# EAGLE design MODULO_DRIVE_CC (EAGLE 7.5.0)
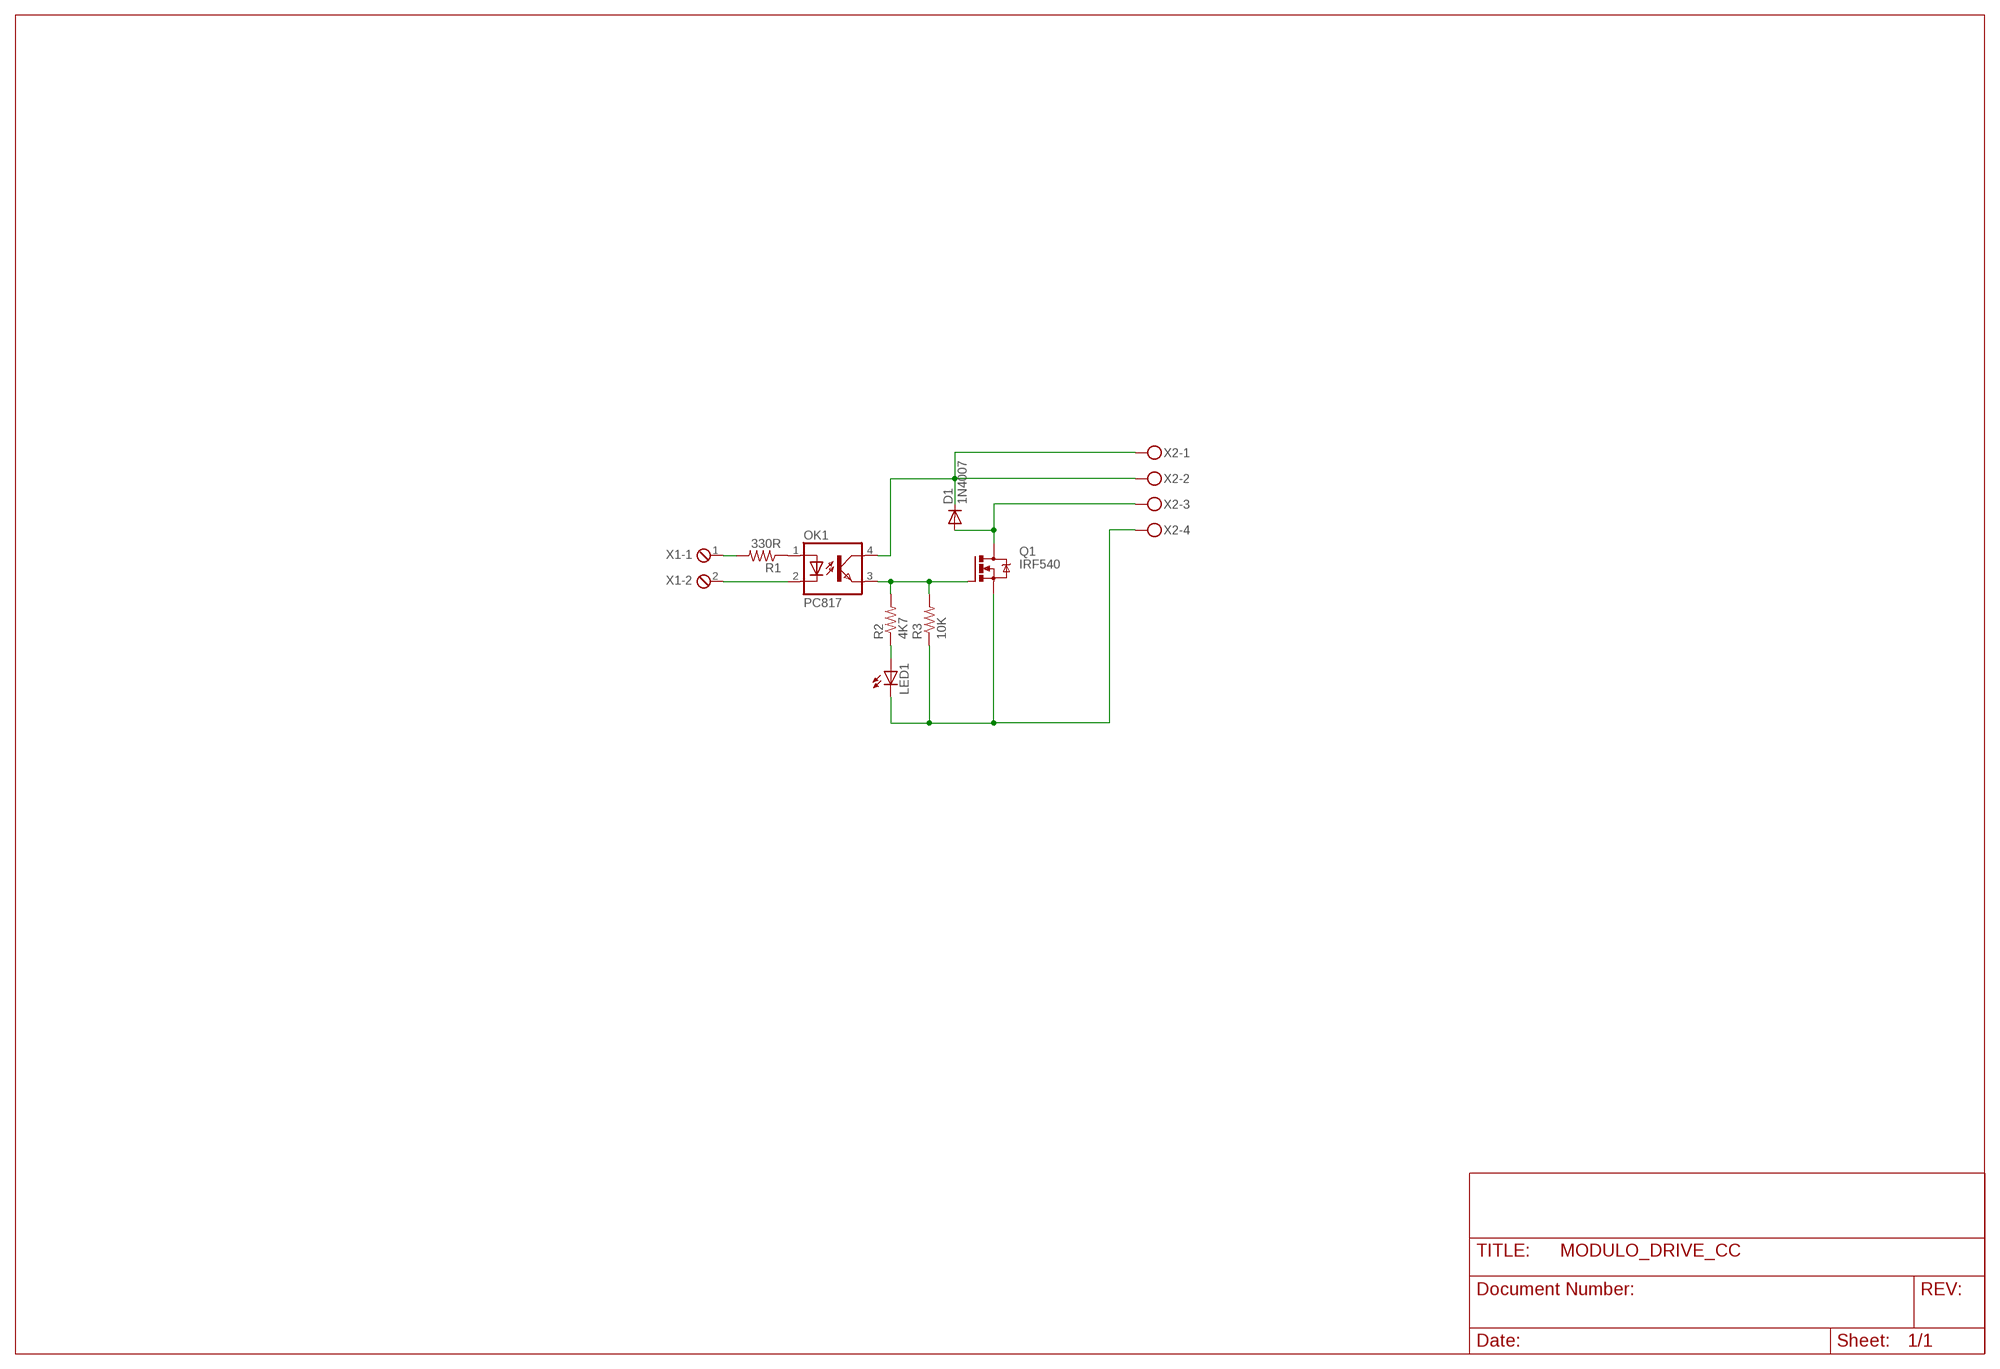
[diagram p0: schematic, sheet 1]

## Parts
D1  1N4007  1N4004  [DO41-10]
LED1  LED3MM  [LED3MM]
OK1  PC817  [DIL04]
Q1  IRF540  [TO220BV]
R1  330R  RESISTORPTH-1/4W  [AXIAL-0.4]
R2  4K7  RESISTORPTH-1/4W  [AXIAL-0.4]
R3  10K  RESISTORPTH-1/4W  [AXIAL-0.4]
X1  MPT2  [2POL254]
X2  MKDSN1,5/4-5,08  [MKDSN1,5/4-5,08]

## Nets
N$35: D1.A Q1.D X2.3
N$36: D1.C OK1.4(COL) X2.1 X2.2
N$37: LED1.K(C) Q1.S R3.P$1 X2.4
N$39: OK1.3(EMIT) Q1.G R2.P$2 R3.P$2
N$41: LED1.A R2.P$1
N$43: OK1.1(A) R1.P$1
N$49: R1.P$2 X1.1
N$50: OK1.2(C) X1.2

## Library data of the parts
D1 = diode:1N4004: DIODE general purpose rectifier, 1 A
LED1 = led:LED: LED OSRAM: - CHIPLED LG R971, LG N971, LY N971, LG Q971, LY Q971, LO R971, LY R971 LH N974, LH R974 LS Q976, LO Q976, LY Q976 LO Q996 - Hyper CHIPLED LW Q18S LB Q993, LB Q99A, LB R99A - SideLED LS A670, LO A670, LY A670, LG A670, LP A670 LB A673, LV A673, LT A673, LW A673 LH A674 LY A675 LS A676, LA A676, LO A676, LY A676, LW A676 LS A679, LY A679, LG A679 - Hyper Micro SIDELED® LS Y876, LA Y876, LO Y876, LY Y876 LT Y87S - SmartLED LW L88C, LW L88S LB L89C, LB L89S, LG L890 LS L89K, LO L89K, LY L89K LS L896, LA L896, LO L896, LY L896 - TOPLED LS T670, LO T670, LY T670, LG T670, LP T670 LSG T670, LSP T670, LSY T670, LOP T670, LYG T670 LG T671, LOG T671, LSG T671 LB T673, LV T673, LT T673, LW T673 LH T674 LS T676, LA T676, LO T676, LY T676, LB T676, LH T676, LSB T676, LW T676 LB T67C, LV T67C, LT T67C, LS T67K, LO T67K, LY T67K, LW E67C LS E67B, LA E67B, LO E67B, LY E67B, LB E67C, LV E67C, LT E67C LW T67C LS T679, LY T679, LG T679 LS T770, LO T770, LY T770, LG T770, LP T770 LB T773, LV T773, LT T773, LW T773 LH T774 LS E675, LA E675, LY E675, LS T675 LS T776, LA T776, LO T776, LY T776, LB T776 LHGB T686 LT T68C, LB T68C - Hyper Mini TOPLED® LB M676 - Mini TOPLED Santana® LG M470 LS M47K, LO M47K, LY M47K Source: http://www.osram.convergy.de LUXEON: - LUMILED® LXK2-PW12-R00, LXK2-PW12-S00, LXK2-PW14-U00, LXK2-PW14-V00 LXK2-PM12-R00, LXK2-PM12-S00, LXK2-PM14-U00 LXK2-PE12-Q00, LXK2-PE12-R00, LXK2-PE12-S00, LXK2-PE14-T00, LXK2-PE14-U00 LXK2-PB12-K00, LXK2-PB12-L00, LXK2-PB12-M00, LXK2-PB14-N00, LXK2-PB14-P00, LXK2-PB14-Q00 LXK2-PR12-L00, LXK2-PR12-M00, LXK2-PR14-Q00, LXK2-PR14-R00 LXK2-PD12-Q00, LXK2-PD12-R00, LXK2-PD12-S00 LXK2-PH12-R00, LXK2-PH12-S00 LXK2-PL12-P00, LXK2-PL12-Q00, LXK2-PL12-R00 Source: www.luxeon.com KINGBRIGHT: KA-3528ASYC Source: www.kingbright.com
OK1 = optocoupler:PC817: SHARP OPTO COUPLER; MPN: PC817X4J000F; OC_FARNELL: 9707727; OC_NEWARK: 97K7059
Q1 = transistor-power:IRF540: HEXFET Power MOSFET
R1-R3 = SparkFun:RESISTOR: Resistor Basic schematic elements and footprints for 0603, 1206, and PTH resistors.
X1 = con-phoenix-254:MPT2: PHOENIX CONNECTOR; OC_FARNELL: unknown; OC_NEWARK: unknown
X2 = con-phoenix-508:MKDSN1,5/4-5,08: MKDSN 1,5/ 4-5,08 Printklemme Nennstrom: 13,5 A Nennspannung: 250 V Rastermaß: 5,08 mm Polzahl: 4 Anschlussart: Schraubanschluss Montage: Löten Anschlussrichtung Leiter/Platine: 0 ° Artikelnummer: 1729144 Source: http://eshop.phoenixcontact.com .. 1729144.pdf; MPN: SMKDSN1,5/4-5,08; OC_FARNELL: 1792905; OC_NEWARK: 70R0300

## Board
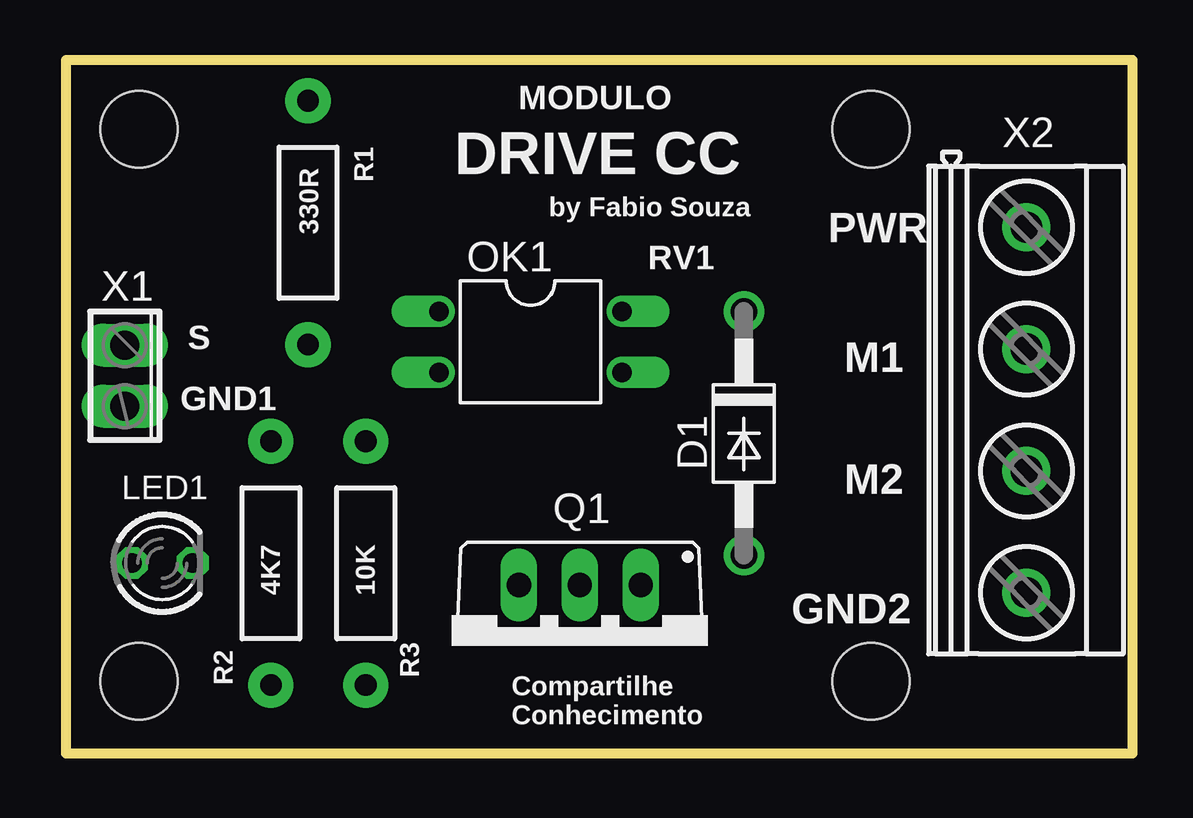
[diagram p1: board, top side]
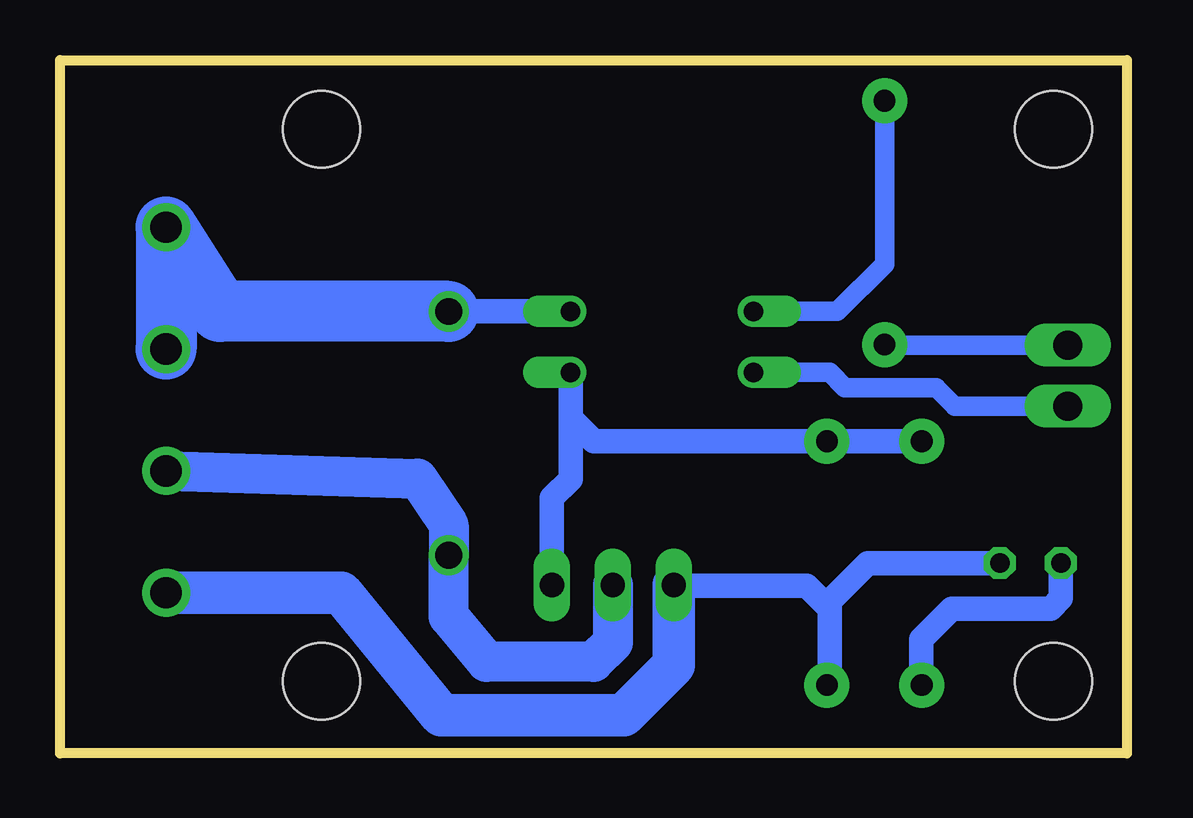
[diagram p2: board, bottom side, seen from below]

Size 44.45 x 28.89 mm. Coordinates in mm from the lower left corner, seen from the top.
Outline: 0,0 44.45,0 44.45,28.89 0,28.89 0,0
Copper layers (1*16): Top 0.035mm / dielectric 1.5mm / Bottom 0.035mm
Design rules "default": minimum track width 10mil, minimum drill 24mil, track to track 8mil, track to pad 8mil, pad to pad 8mil, via to via 8mil, smd to smd 8mil, copper to edge 40mil, drill to drill 8mil, minimum pad ring 10mil, minimum via ring 8mil, stop-mask expansion 4mil, vias tented up to drill 0mil, thermal gap 10mil
Holes 3.2 mm at 3.05,3.01 3.05,26.01 33.55,26.01 33.55,3.01

### Footprints (pad centres in the part's own frame; a part is rotated, then mirrored left to right if it is on the bottom)
DO41-10 = drill 1.118: A 5.08,0; C -5.08,0
LED3MM = drill 0.813 octagon: A -1.27,0; K 1.27,0
DIL04 = drill 0.813 offset: 1 -1.27,-3.81; 2 1.27,-3.81; 3 1.27,3.81; 4 -1.27,3.81
TO220BV = drill 1.016 long: D 0,-2.54; G -2.54,-2.54; S 2.54,-2.54
AXIAL-0.4 = drill 0.9 pad 1.88: P$1 -5.08,0; P$2 5.08,0
2POL254 = drill 1.2 long: 1 -1.27,0; 2 1.27,0
MKDSN1,5/4-5,08 = drill 1.3 pad 2: 1 -7.641,0.025; 2 -2.561,0.025; 3 2.519,0.025; 4 7.599,0.025

### Placement (x,y rotation side)
D1  28.26,13.34 270 top
LED1  4.02,7.93 0 top
OK1  19.37,17.14 270 top
Q1  21.42,4.49 180 top
R1  10.09,22.11 270 top
R2  8.54,7.92 90 top
R3  12.5,7.92 90 top
X1  2.46,15.74 270 top
X2  40.01,14.29 270 top

### Tracks (layer width: path | path; a pad name or v marks a point on that pad's centre or on a via)
N$35
  Bottom 1.676: X2.3 29.55,11.45 28.26,9.53 D1.A 28.26,5.71 26.67,3.81 22.23,3.81 21.42,4.62 Q1.D
N$36
  Bottom 1.016: OK1.4 D1.C
  Bottom 2.54: X2.2 X2.1 37.79,18.41 D1.C
N$37
  Bottom 1.016: LED1.K 10.8,7.93 12.38,6.35 12.38,6.03 | 12.38,2.96 R3.P$1 | 12.38,2.96 12.38,2.54 | 12.38,2.96 12.38,6.03 | 12.38,6.03 13.34,6.99 18.84,6.99 Q1.S
  Bottom 1.778: X2.4 32.73,6.69 28.57,1.59 20.95,1.59 18.88,3.67 Q1.S
N$39
  Bottom 1.016: R2.P$2 R3.P$2 22.21,13.01 23.18,13.97 | 23.18,13.97 23.18,14.29 OK1.3 | Q1.G 23.96,10.65 23.18,11.43 23.18,13.97
N$41
  Bottom 1.016: LED1.A 2.75,6.46 3.17,6.03 7.3,6.03 8.57,4.76 8.57,2.87 R2.P$1
N$43
  Bottom 0.813: R1.P$1 10.09,20.39 12.06,18.41 OK1.1
N$49
  Bottom 0.813: X1.1 10.07,17.01 R1.P$2
N$50
  Bottom 0.813: X1.2 7.17,14.47 7.94,15.24 11.75,15.24 12.38,15.88 OK1.2

### Text on the board
tPlace: MODULO | DRIVE CC | by Fabio Souza | PWR | RV1 | S | M1 | GND1 | M2 | GND2 | Compartilhe / Conhecimento